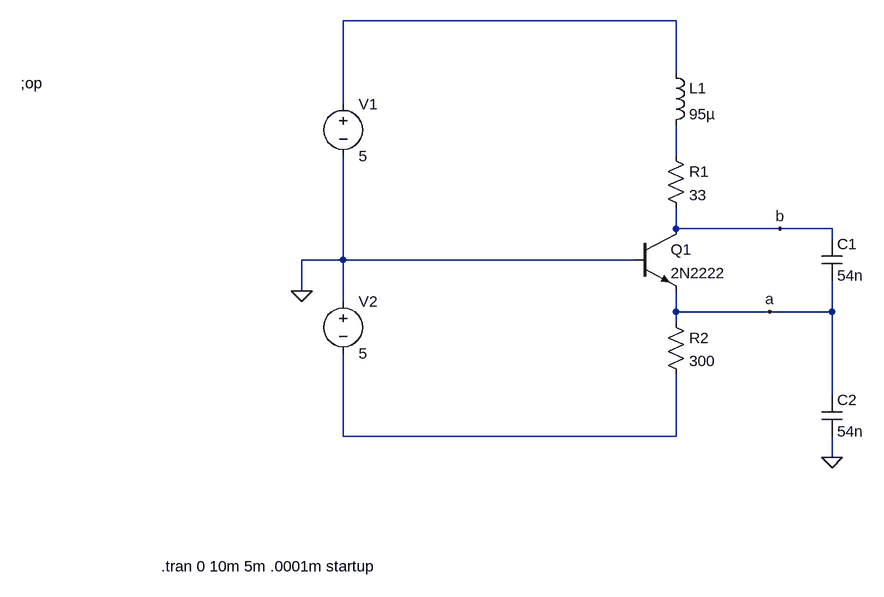
[diagram p0: schematic Colpitts_caos.asc]
Colpitts_caos.asc, the LTspice schematic file:
Version 4
SHEET 1 880 684
WIRE 240 -176 -272 -176
WIRE 240 -96 240 -176
WIRE -272 -48 -272 -176
WIRE 240 32 240 -16
WIRE 240 144 240 112
WIRE 400 144 240 144
WIRE 480 144 400 144
WIRE 480 160 480 144
WIRE -272 192 -272 32
WIRE -272 192 -336 192
WIRE 176 192 -272 192
WIRE -336 240 -336 192
WIRE -272 256 -272 192
WIRE 240 272 240 240
WIRE 384 272 240 272
WIRE 480 272 480 224
WIRE 480 272 384 272
WIRE 240 288 240 272
WIRE 480 400 480 272
WIRE -272 464 -272 336
WIRE 240 464 240 368
WIRE 240 464 -272 464
WIRE 480 496 480 464
FLAG -336 240 0
FLAG 480 496 0
FLAG 384 272 a
FLAG 400 144 b
SYMBOL npn 176 144 R0
SYMATTR InstName Q1
SYMATTR Value 2N2222
SYMBOL res 224 16 R0
SYMATTR InstName R1
SYMATTR Value 33
SYMBOL ind 224 -112 R0
SYMATTR InstName L1
SYMATTR Value 95µ
SYMBOL cap 464 160 R0
SYMATTR InstName C1
SYMATTR Value 54n
SYMBOL cap 464 400 R0
SYMATTR InstName C2
SYMATTR Value 54n
SYMBOL res 224 272 R0
SYMATTR InstName R2
SYMATTR Value 300
SYMBOL voltage -272 -64 R0
WINDOW 123 0 0 Left 2
WINDOW 39 0 0 Left 2
SYMATTR InstName V1
SYMATTR Value 5
SYMBOL voltage -272 240 R0
WINDOW 123 0 0 Left 2
WINDOW 39 0 0 Left 2
SYMATTR InstName V2
SYMATTR Value 5
TEXT -552 664 Left 2 !.tran 0 10m 5m .0001m startup
TEXT -768 -80 Left 2 !;op

The netlist it stands for:
* Colpitts_caos.asc
Q1 b 0 a 0 2N2222
R1 N002 b 33
L1 N001 N002 95µ
C1 b a 54n
C2 a 0 54n
R2 a N003 300
V1 N001 0 5
V2 0 N003 5
.model NPN NPN
.model PNP PNP
.lib standard.bjt
.tran 0 10m 5m .0001m startup
;op
.backanno
.end